# Altium schematic sheet SmartSwitch2.0.SchDoc
size A3
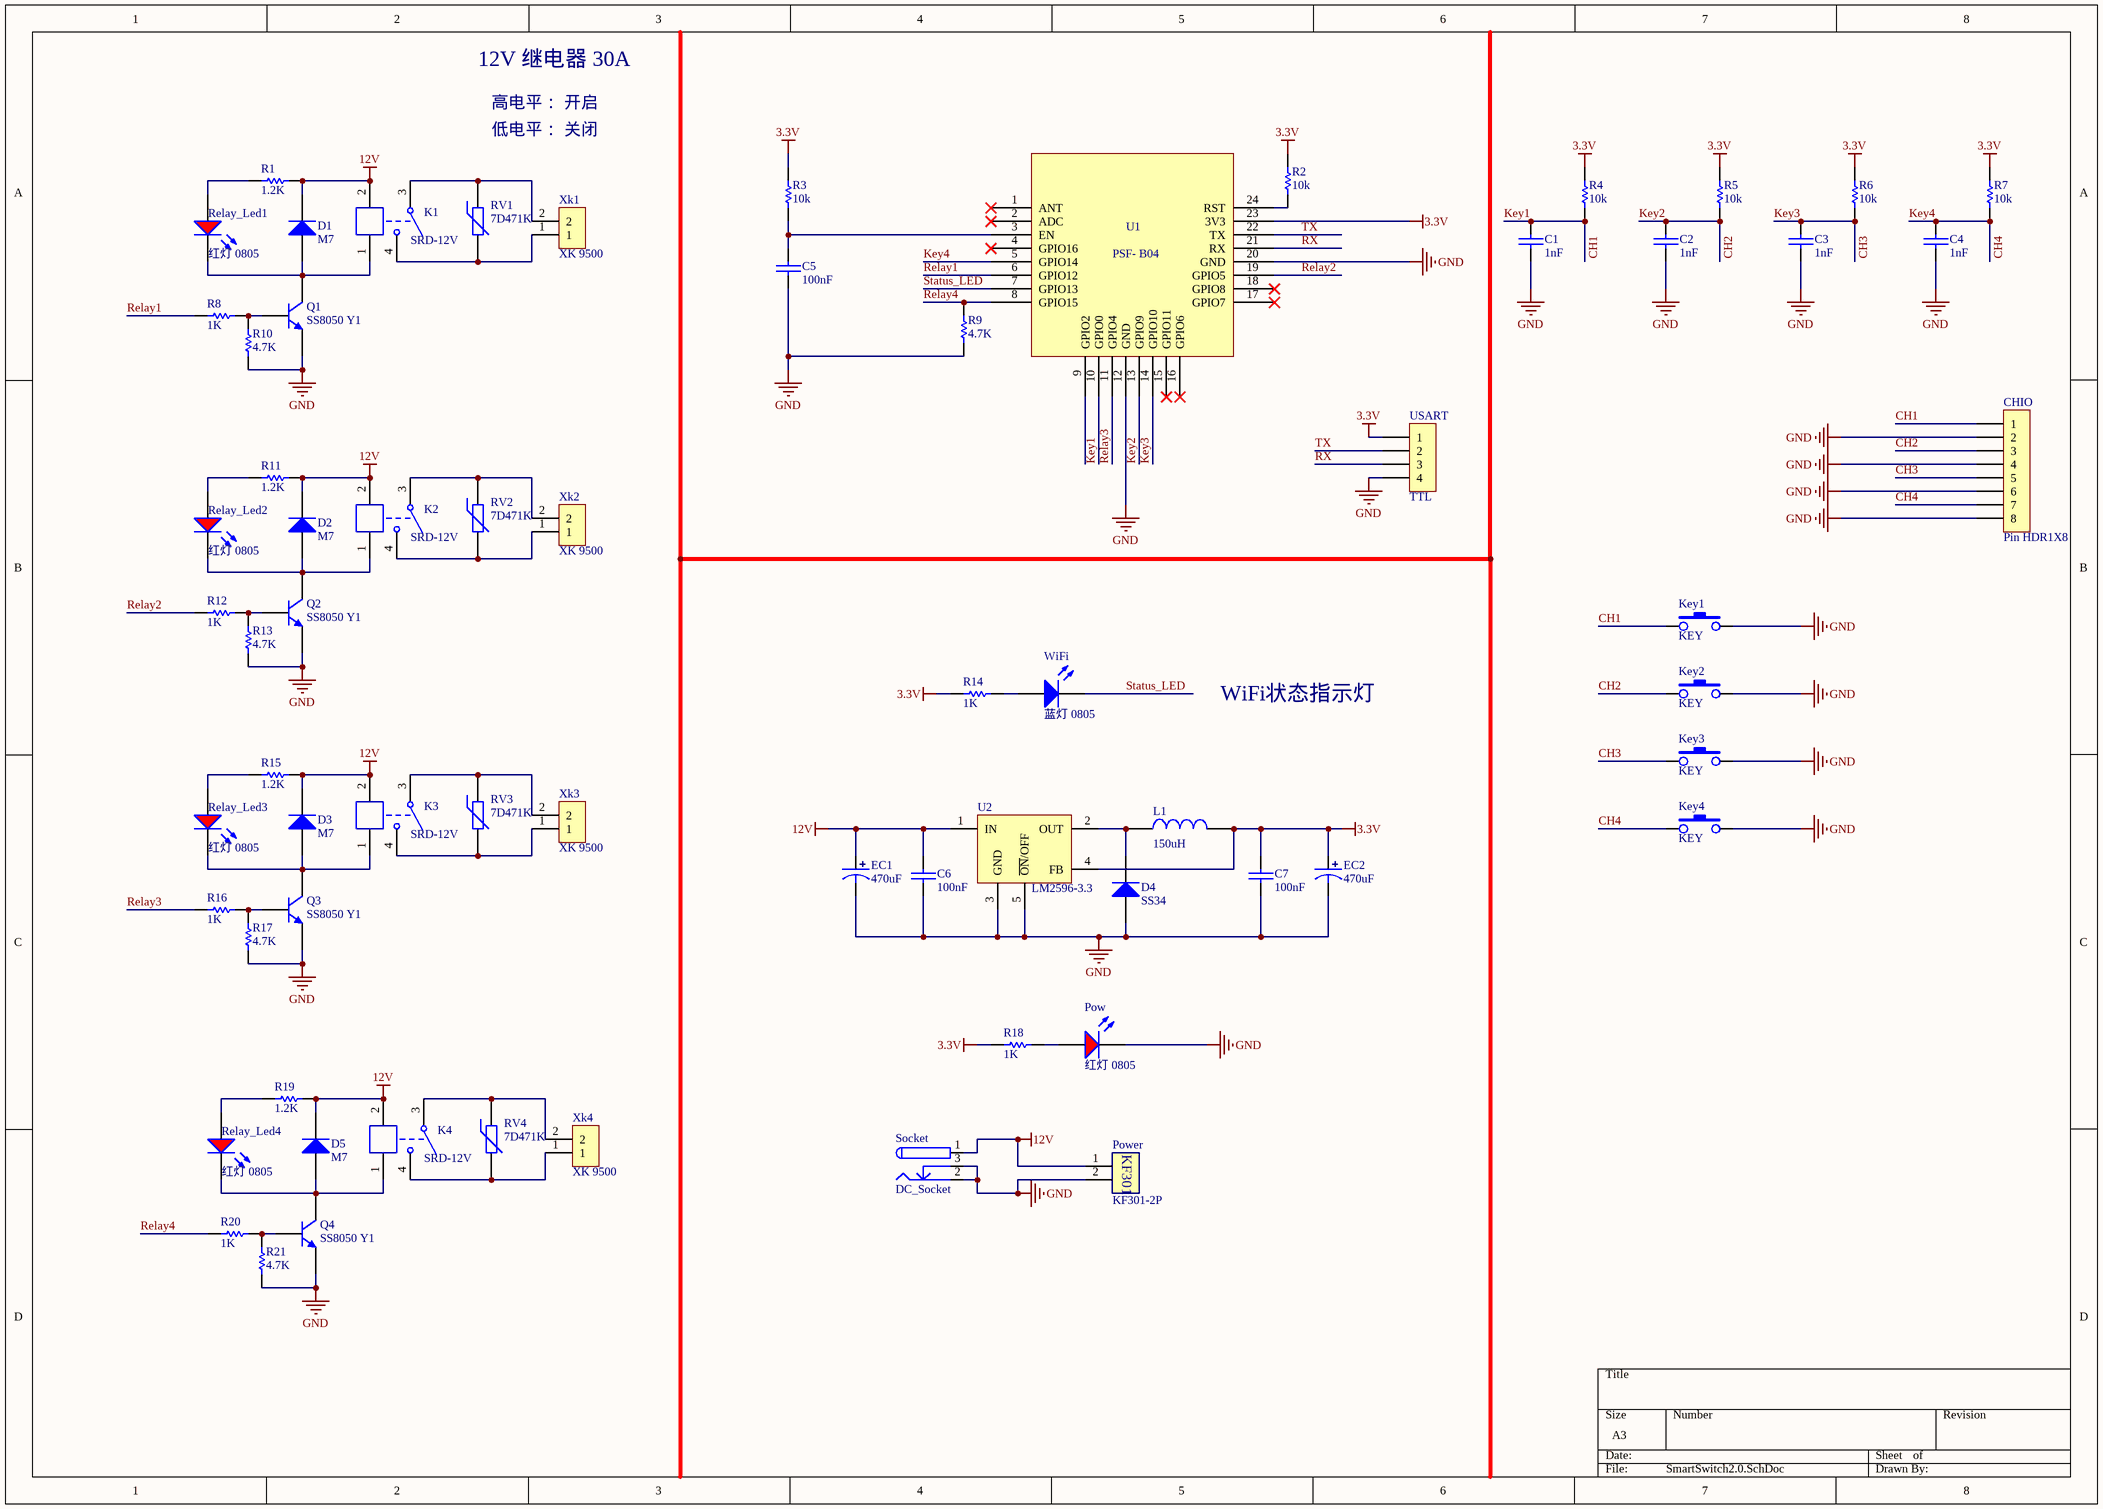
[diagram p0: SmartSwitch2.0.SchDoc]

## Parts
C1  1nF  [0603C]
C2  1nF  [0603C]
C3  1nF  [0603C]
C4  1nF  [0603C]
C5  100nF  [0603C]
C6  100nF  [0603C]
C7  100nF  [0603C]
CHIO  Pin HDR1X8  [Pin HDR1X8/2.54mm-S]
D1  M7  [SMA(DO-214AC)_S1]
D2  M7  [SMA(DO-214AC)_S1]
D3  M7  [SMA(DO-214AC)_S1]
D4  SS34  [SMA(DO-214AC)_S1]
D5  M7  [SMA(DO-214AC)_S1]
EC1  470uF  [SMD-EC8X8X10]
EC2  470uF  [SMD-EC8X8X10]
K1  SRD-12V  [SLA-xxVDC-SL-A]
K2  SRD-12V  [SLA-xxVDC-SL-A]
K3  SRD-12V  [SLA-xxVDC-SL-A]
K4  SRD-12V  [SLA-xxVDC-SL-A]
Key1  KEY  [DIP-6X6X4.3]
Key2  KEY  [DIP-6X6X4.3]
Key3  KEY  [DIP-6X6X4.3]
Key4  KEY  [DIP-6X6X4.3]
L1  150uH  [PK0810]
Pow  红灯 0805  [0805_LED_S1]
Power  KF301-2P  [KF301-5.0-2P]
Q1  SS8050 Y1  [SOT-23(SOT-23-3)]
Q2  SS8050 Y1  [SOT-23(SOT-23-3)]
Q3  SS8050 Y1  [SOT-23(SOT-23-3)]
Q4  SS8050 Y1  [SOT-23(SOT-23-3)]
R1  1.2K  [0603R]
R2  10k  [0603R]
R3  10k  [0603R]
R4  10k  [0603R]
R5  10k  [0603R]
R6  10k  [0603R]
R7  10k  [0603R]
R8  1K  [0603R]
R9  4.7K  [0603R]
R10  4.7K  [0603R]
R11  1.2K  [0603R]
R12  1K  [0603R]
R13  4.7K  [0603R]
R14  1K  [0603R]
R15  1.2K  [0603R]
R16  1K  [0603R]
R17  4.7K  [0603R]
R18  1K  [0603R]
R19  1.2K  [0603R]
R20  1K  [0603R]
R21  4.7K  [0603R]
Relay_Led1  红灯 0805  [0805_LED_S1]
Relay_Led2  红灯 0805  [0805_LED_S1]
Relay_Led3  红灯 0805  [0805_LED_S1]
Relay_Led4  红灯 0805  [0805_LED_S1]
RV1  7D471K  [Varistor-7.5mm]
RV2  7D471K  [Varistor-7.5mm]
RV3  7D471K  [Varistor-7.5mm]
RV4  7D471K  [Varistor-7.5mm]
Socket  DC_Socket  [DC-005]
U1  PSF- B04  [PSF- B04]
U2  LM2596-3.3  [TO263-5A]
USART  TTL  [Pin HDR1X4/2.54mm-S]
WiFi  蓝灯 0805  [0805_LED_S1]
Xk1  XK 9500  [XK 9500]
Xk2  XK 9500  [XK 9500]
Xk3  XK 9500  [XK 9500]
Xk4  XK 9500  [XK 9500]

## Nets
3.3V: C7.2 EC2.1 L1.2 R2.1 R3.2 R4.1 R5.1 R6.1 R7.1 R14.1 R18.1 U1.23(3V3) U2.4(FB) USART.1
12V: C6.2 D1.2(K) D2.2(K) D3.2(K) D5.2(K) EC1.1 K1.2 K2.2 K3.2 K4.2 Power.1 R1.1 R11.1 R15.1 R19.1 Socket.1 U2.1(IN)
GND: C1.1 C2.1 C3.1 C4.1 C5.1 C6.1 C7.1 CHIO.2 CHIO.4 CHIO.6 CHIO.8 D4.1(A) EC1.2 EC2.2 Key1.3 Key2.3 Key3.3 Key4.3 Pow.K Power.2 Q1.2(E) Q2.2(E) Q3.2(E) Q4.2(E) R9.1 R10.1 R13.1 R17.1 R21.1 Socket.2 Socket.3 U1.12(GND) U1.20(GND) U2.3(GND) U2.5(~{ON}/OFF) USART.4
CH1: C1.2 CHIO.1 Key1.1 R4.2 U1.10(GPIO0)  [also labelled Key1]
CH2: C2.2 CHIO.3 Key2.1 R5.2 U1.13(GPIO9)  [also labelled Key2]
CH3: C3.2 CHIO.5 Key3.1 R6.2 U1.14(GPIO10)  [also labelled Key3]
CH4: C4.2 CHIO.7 Key4.1 R7.2 U1.5(GPIO14)  [also labelled Key4]
Relay1: R8.1 U1.6(GPIO12)
Relay2: R12.1 U1.19(GPIO5)
Relay3: R16.1 U1.11(GPIO4)
Relay4: R9.2 R20.1 U1.8(GPIO15)
RX: U1.21(RX) USART.3
Status_LED: U1.7(GPIO13) WiFi.K
TX: U1.22(TX) USART.2
NetC5_2: C5.2 R3.1 U1.3(EN)
NetD1_1: D1.1(A) K1.1 Q1.3(C) Relay_Led1.K
NetD2_1: D2.1(A) K2.1 Q2.3(C) Relay_Led2.K
NetD3_1: D3.1(A) K3.1 Q3.3(C) Relay_Led3.K
NetD4_2: D4.2(K) L1.1 U2.2(OUT)
NetD5_1: D5.1(A) K4.1 Q4.3(C) Relay_Led4.K
NetK1_3: K1.3 RV1.1 Xk1.2
NetK1_4: K1.4 RV1.2 Xk1.1
NetK2_3: K2.3 RV2.1 Xk2.2
NetK2_4: K2.4 RV2.2 Xk2.1
NetK3_3: K3.3 RV3.1 Xk3.2
NetK3_4: K3.4 RV3.2 Xk3.1
NetK4_3: K4.3 RV4.1 Xk4.2
NetK4_4: K4.4 RV4.2 Xk4.1
NetPow_A: Pow.A R18.2
NetQ1_1: Q1.1(B) R8.2 R10.2
NetQ2_1: Q2.1(B) R12.2 R13.2
NetQ3_1: Q3.1(B) R16.2 R17.2
NetQ4_1: Q4.1(B) R20.2 R21.2
NetR1_2: R1.2 Relay_Led1.A
NetR2_2: R2.2 U1.24(RST)
NetR11_2: R11.2 Relay_Led2.A
NetR14_2: R14.2 WiFi.A
NetR15_2: R15.2 Relay_Led3.A
NetR19_2: R19.2 Relay_Led4.A

Not connected (* = marked no-connect by the designer): U1 1(ANT)* 2(ADC)* 4(GPIO16)* 9(GPIO2) 15(GPIO11)* 16(GPIO6)* 17(GPIO7)* 18(GPIO8)*

## Notes on the sheet
- 12V 继电器 30A
- 高电平： 开启
- 低电平： 关闭
- WiFi状态指示灯
- (in symbol KF301-2P) KF301

## Library data of the parts
C1-C7 = CAP: 无极性电容
D1-D3 D5 = SMA(DO-214AC) M7: 二极管; 备注: 1N4007 4007 编号C2464 已经停售, 使用新物料编号C95872; ComponentLink1Description: 供应商链接; ComponentLink1URL: http://www.szlcsc.com/product/details_2841.html; Package: SMA(DO-214AC); Supplier: LC; SuppliersPartNumber: C95872
D4 = SMA(DO-214AC) SS54: 二极管; ComponentLink1Description: 供应商链接; ComponentLink1URL: http://www.szlcsc.com/product/details_23178.html; Package: SMA(DO-214AC); Supplier: LC; SuppliersPartNumber: C22452
EC1 EC2 = SMD_ECAP: 贴片电解电容
K1-K4 = SLA-12VDC-SL-A: 12V一组常开
L1 = INDUCTOR
Pow Relay_Led1-Relay_Led4 = 0805 红灯: 发光二极管; ComponentLink1Description: 供应商链接; ComponentLink1URL: http://www.szlcsc.com/product/details_2668.html; Package: 0805; Supplier: LC; SuppliersPartNumber: C2295
Q1-Q4 = SOT-23 SS8050 Y1: 三极管; ComponentLink1Description: 供应商链接; ComponentLink1URL: http://www.szlcsc.com/product/details_2507.html; Package: SOT-23; Supplier: LC; SuppliersPartNumber: C2150
R1-R21 = RES
RV1-RV4 = Varistor: 压敏电阻
U2 = LM2596-3.3: DC降压芯片
USART = Pin HDR1X4
WiFi = 0805 蓝灯: 发光二极管; ComponentLink1Description: 供应商链接; ComponentLink1URL: http://www.szlcsc.com/product/details_2666.html; Package: 0805; Supplier: LC; SuppliersPartNumber: C2293